# EAGLE design M_D_ext_power-solar1 (EAGLE 9.6.2)
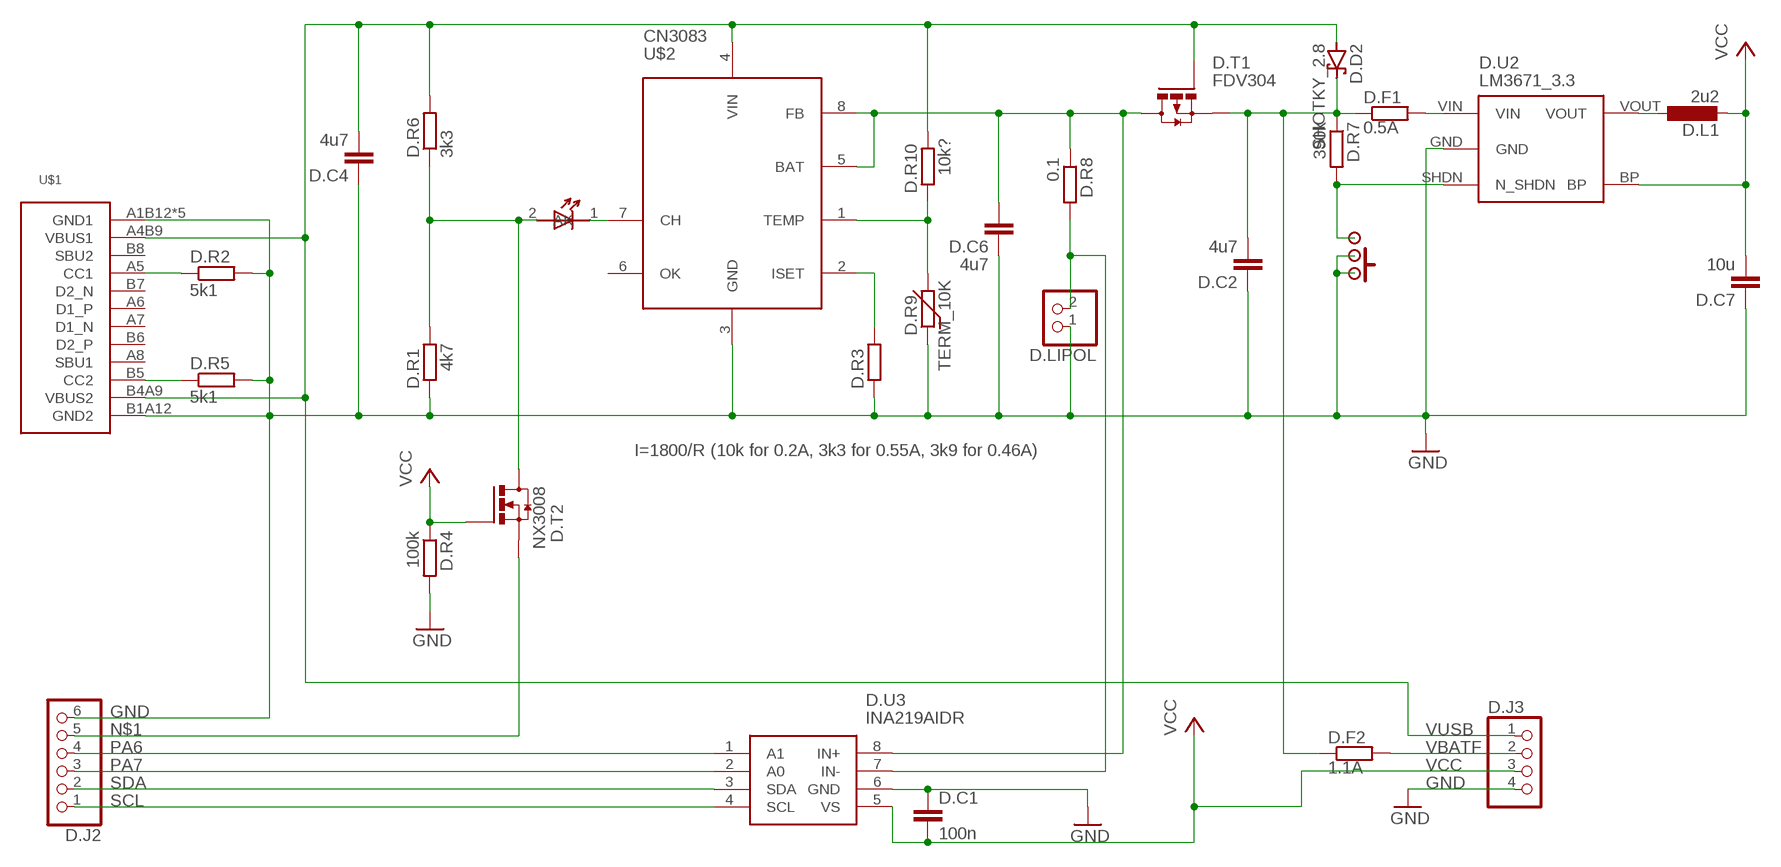
[diagram p0: schematic, sheet 1]

## Parts
D.C1  100n  C-EUC0603  [C0603]
D.C2  4u7  C-EUC0603  [C0603]
D.C4  4u7  C-EUC0603  [C0603]
D.C6  4u7  C-EUC0603  [C0603]
D.C7  10u  C-EUC0805  [C0805]
D.D1  LED_1.8  [LED_1.8]
D.D2  SHOTKY_2.8  [SHOTKY_2.8]
D.F1  0.5A  R-EU_R0805  [R0805]
D.F2  1.1A  R-EU_R0805  [R0805]
D.J2  PINHD-1X6  [1X06]
D.J3  PINHD-1X4  [1X04]
D.L1  2u2  L-EUL3230M  [L3230M]
D.LIPOL  PINHD-1X2  [1X02]
D.ON/OFF/RESET  SWITCH  [SWITCH]
D.R1  4k7  R-EU_R0603  [R0603]
D.R2  5k1  R-EU_R0603  [R0603]
D.R3  I=1800/R (10k for 0.2A, 3k3 for 0.55A, 3k9 for 0.46A)  R-EU_R0603  [R0603]
D.R4  100k  R-EU_R0603  [R0603]
D.R5  5k1  R-EU_R0603  [R0603]
D.R6  3k3  R-EU_R0603  [R0603]
D.R7  390k  R-EU_R0603  [R0603]
D.R8  0.1  R-EU_R0805  [R0805]
D.R9  TERM_10K  THERM  [THERM]
D.R10  10k?  R-EU_R0603  [R0603]
D.T1  FDV304  P-MOSFET  [SO23]
D.T2  NX3008  N-MOSFET  [SO23]
D.U2  LM3671_3.3  STABILISER_APE8865  [SOT32-5]
D.U3  INA219AIDR  [SOIC127P600X175-8N]
U$1  USB-C  [USB-C]
U$2  CN3083  [SOP8]

## Nets
GND: D.C1.1 D.C2.1 D.C4.1 D.C6.1 D.C7.1 D.J2.6 D.J3.4 D.LIPOL.1 D.ON/OFF/RESET.P$1 D.ON/OFF/RESET.P$2 D.ON/OFF/RESET.P$4 D.R1.1 D.R2.2 D.R3.1 D.R4.2 D.R5.2 D.R9.1 D.U2.GND D.U3.6(GND) U$1.A1B12(GND1) U$1.B1A12(GND2) U$1.SH1(GND1) U$1.SH2(GND1) U$1.SH3(GND1) U$1.SH4(GND1) U$2.3(GND)
IN+: D.LIPOL.2 D.R8.2 D.U3.7(IN-)
IN-: D.C6.2 D.R8.1 D.T1.D D.U3.8(IN+) U$2.5(BAT) U$2.8(FB)
N$1: D.J2.5 D.T2.S
N$2: D.L1.1 D.U2.VOUT
N$3: D.D1.1(K) U$2.7(CH)
N$4: D.R5.1 U$1.B5(CC2)
N$5: D.ON/OFF/RESET.P$3 D.ON/OFF/RESET.P$5 D.R7.2 D.U2.SHDN(N_SHDN)
N$6: D.R2.1 U$1.A5(CC1)
N$7: D.R3.2 U$2.2(ISET)
N$8: D.R9.2 D.R10.1 U$2.1(TEMP)
N$9: D.F1.2 D.U2.VIN
PA3: D.D1.2(A) D.R1.2 D.R6.1 D.T2.D
PA6: D.J2.4 D.U3.1(A1)
PA7: D.J2.3 D.U3.2(A0)
SCL: D.J2.1 D.U3.4(SCL)
SDA: D.J2.2 D.U3.3(SDA)
VBATF: D.F2.2 D.J3.2
VCC: D.C1.2 D.C7.2 D.J3.3 D.L1.2 D.R4.1 D.T2.G D.U2.BP D.U3.5(VS)
VMOT: D.C2.2 D.D2.K(C) D.F1.1 D.F2.1 D.R7.1 D.T1.S
VUSB: D.C4.2 D.D2.A D.J3.1 D.R6.2 D.R10.2 D.T1.G U$1.A4B9(VBUS1) U$1.B4A9(VBUS2) U$2.4(VIN)
Unconnected: U$1.A6(D1_P) U$1.A7(D1_N) U$1.A8(SBU1) U$1.B6(D2_P) U$1.B7(D2_N) U$1.B8(SBU2) U$2.6(OK)

## Library data of the parts
D.C1 D.C2 D.C4 D.C6 D.C7 = rcl:C-EU: CAPACITOR, European symbol; SPICEPREFIX: C
D.D1 = hugo:LED_1.8
D.D2 = hugo:SHOTKY_2.8
D.F1 D.F2 D.R1-D.R8 D.R10 = rcl:R-EU_: RESISTOR, European symbol; SPICEPREFIX: R
D.J2 = pinhead2:PINHD-1X6: PIN HEADER
D.J3 = pinhead2:PINHD-1X4: PIN HEADER
D.L1 = rcl:L-EU: INDUCTOR, European symbol; SPICEPREFIX: L
D.LIPOL = pinhead2:PINHD-1X2: PIN HEADER
D.ON/OFF/RESET = hugo:SWITCH
D.R9 = hugo:THERM
D.T1 = hugo:P-MOSFET
D.T2 = hugo:N-MOSFET
D.U2 = !stavebnice03:STABILISER_APE8865
D.U3 = SamacSys_Parts:INA219AIDR: 26-V, Bidirectional, Zero-Drift, High-Side, I2C Out Current/Power Monitor Source: Datasheet <http://www.ti.com/lit/gpn/ina219>; DESCRIPTION: 26-V, Bidirectional, Zero-Drift, High-Side, I2C Out Current/Power Monitor; HEIGHT: 1.75mm; MANUFACTURER_NAME: Texas Instruments; MANUFACTURER_PART_NUMBER: INA219AIDR; MOUSER_PART_NUMBER: 595-INA219AIDR; MOUSER_PRICE-STOCK: https://www.mouser.co.uk/ProductDetail/Texas-Instruments/INA219AIDR?qs=XGzIaZb%2FFYIE5YcOHTnKDA%3D%3D
U$1 = hugo:USB-C
U$2 = hugo:CN3083

## Board
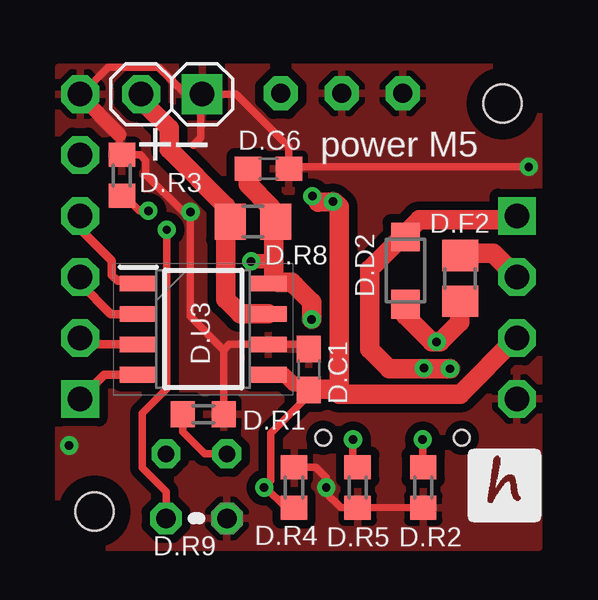
[diagram p1: board, top side]
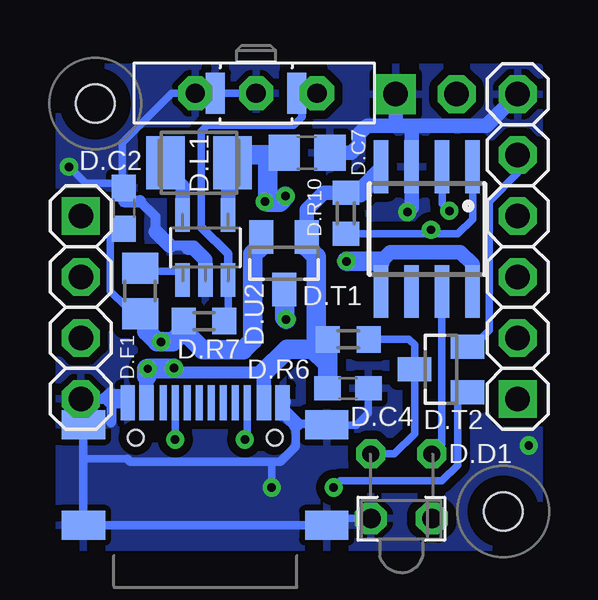
[diagram p2: board, bottom side, seen from below]

No outline drawn. Coordinates in mm, seen from the top.
Copper layers (1*16): Top 0.035mm / dielectric 1.5mm / Bottom 0.035mm
Design rules "default *": minimum track width 10mil, minimum drill 0.35mm, track to track 6mil, track to pad 6mil, pad to pad 6mil, via to via 10mil, smd to smd 10mil, copper to edge 15mil, drill to drill 15mil, minimum pad ring 10mil, minimum via ring 8mil, stop-mask expansion 4mil, vias tented up to drill 0mil, thermal gap 10mil
Holes 1.6 mm at 2,2 19,19
tRestrict: area 18,18 to 20,20; area 1,1 to 3,3
bRestrict: area 1,1 to 3,3; area 18,18 to 20,20

### Footprints (pad centres in the part's own frame; a part is rotated, then mirrored left to right if it is on the bottom)
C0603 = smd 1.1 x 1: 1 -0.85,0; 2 0.85,0
C0805 = smd 1.3 x 1.5: 1 -0.95,0; 2 0.95,0
LED_1.8 = drill 0.7 octagon: 1 -1.27,-0.4; 2 1.27,-0.4
SHOTKY_2.8 = smd 1.2 x 1.2: A -1.4,0; K 1.4,0
R0805 = smd 1.3 x 1.5: 1 -0.95,0; 2 0.95,0
1X06 = drill 1.016 pad 1.575 square: 1 -6.35,0 | drill 1.016 pad 1.575 octagon: 2 -3.81,0; 3 -1.27,0; 4 1.27,0; 5 3.81,0; 6 6.35,0
1X04 = drill 1.016 pad 1.575 square: 1 -3.81,0 | drill 1.016 pad 1.575 octagon: 2 -1.27,0; 3 1.27,0; 4 3.81,0
L3230M = smd 1.6 x 2.2: 1 -1.4,0; 2 1.4,0
1X02 = drill 1.016 pad 1.676 square: 1 -1.27,0 | drill 1.016 pad 1.575 octagon: 2 1.27,0
SWITCH = drill 0.8 pad 1.422 octagon: P$1 -2.54,0; P$2 0,0; P$3 2.54,0 | smd 0.8 x 1.7: P$4 -1.7,0; P$5 1.7,0
R0603 = smd 1 x 1.1: 1 -0.85,0; 2 0.85,0
THERM = drill 0.813 octagon: 1 -1.27,0; 2 1.27,0
SO23 = smd 1 x 1.4: D 0,1.1; G -0.95,-1.1; S 0.95,-1.1
SOT32-5 = smd 0.6 x 1.4: BP 0.95,1.35; GND 0,-1.35; SHDN 0.95,-1.35; VIN -0.95,-1.35; VOUT -0.95,1.35
SOIC127P600X175-8N = smd 1.528 x 0.65: 1 -2.711,1.905; 2 -2.711,0.635; 3 -2.711,-0.635; 4 -2.711,-1.905; 5 2.711,-1.905; 6 2.711,-0.635; 7 2.711,0.635; 8 2.711,1.905
USB-C = smd 0.6 x 1.45: A1B12 -3.235,3.825; A4B9 -2.46,3.825; B1A12 3.215,3.825; B4A9 2.44,3.825 | smd 0.3 x 1.45: A5 -1.26,3.825; A6 -0.26,3.825; A7 0.24,3.825; A8 1.24,3.825; B5 1.74,3.825; B6 0.74,3.825; B7 -0.76,3.825; B8 -1.76,3.825 | smd 1.8 x 1.2: SH1 -5.08,2.91; SH2 -5.08,-1.27; SH3 5.06,-1.27; SH4 5.06,2.91 | hole 0.65: 2.88,2.38; -2.9,2.38
SOP8 = smd 0.6 x 2.2: 1 -1.905,-2.6; 2 -0.635,-2.6; 3 0.635,-2.6; 4 1.905,-2.6; 5 1.905,2.6; 6 0.635,2.6; 7 -0.635,2.6; 8 -1.905,2.6

### Placement (x,y rotation side)
D.C1  10.92,7.92 270 top
D.C2  17.81,14.63 270 bottom
D.C4  8.47,7.13 180 bottom
D.C6  9.25,16.29 180 top
D.C7  10.17,16.95 180 bottom
D.D1  6.25,4 180 bottom
D.D2  14.96,12.04 270 top
D.F1  17.13,11.18 90 bottom
D.F2  17.24,11.71 90 top
D.J2  1.4,13.04 90 bottom
D.J3  19.6,10.5 270 bottom
D.L1  14.68,16.54 0 bottom
D.LIPOL  5.21,19.39 180 top
D.ON/OFF/RESET  12.3,19.42 0 bottom
D.R1  6.53,6.05 180 top
D.R2  15.7,3 270 top
D.R3  3.14,16 270 top
D.R4  10.31,3 90 top
D.R5  12.96,3 270 top
D.R6  8.46,9.17 180 bottom
D.R7  14.47,9.93 0 bottom
D.R8  8.6,14.08 180 top
D.R9  6.25,1.71 180 top
D.R10  8.56,14.43 90 bottom
D.T1  11.13,12.34 180 bottom
D.T2  4.6,7.92 90 bottom
D.U2  14.41,13 0 bottom
D.U3  6.53,9.6 0 top
U$1  14.41,2.7 0 bottom
U$2  5.18,13.77 180 bottom

### Tracks (layer width: path | path; a pad name or v marks a point on that pad's centre or on a via)
GND  (via drill 0.35)
  Top 0.305: 11.16,9.01 D.C1.1 10.73,8.97 D.U3.6 7.62,8.97 7.38,8.73 | D.R2.2 15.7,2.17 D.R5.2 12.25,2.17 11.65,2.77 v11.65,3 11.65,3.4 11.21,3.85 D.R4.2 | D.LIPOL.1 7.91,19.39 10.1,17.2 D.C6.1 10.17,16.36 v20.09,16.36 | 1.4,19.33 D.J2.6 1.46,19.39 2.58,20.51 4.67,20.51 6.43,18.75 6.43,17.57 6.12,17.26 | 3.04,17.69 3.04,16.96 D.R3.1 | D.R3.1 3.37,16.63 | 7.38,8.73 D.R1.1 | 7.38,8.73 5.98,10.12 5.98,14.46 v6,14.48 5.69,14.48 4.14,16.03 4.14,16.61 3.9,16.86 D.R3.1
  Top 0.61: 3.04,17.69 1.4,19.33
  Bottom 0.254: 6.15,17.97 6.03,18.08
  Bottom 0.305: 17.68,4.2 19.49,4.2 19.49,4.19 | 17.87,15.82 17.87,17.36 15.81,19.42 D.ON/OFF/RESET.P$1 | 6.75,19.66 D.LIPOL.1 | 11.65,3.13 v11.65,3 | v11.65,3 11.63,2.97 | D.ON/OFF/RESET.P$1 D.ON/OFF/RESET.P$2 | D.ON/OFF/RESET.P$4 D.ON/OFF/RESET.P$1 | v20.09,16.36 19.41,15.67 18,15.67 D.C2.1 17.8,14.94 | v11.65,3 11.65,4.07 | D.R9.1 9.07,1.71 U$1.SH3 | 9.45,5.71 9.4,5.66 9.33,5.59 8.13,5.59 7.62,6.1 D.C4.1 | v6,14.48 5.82,14.66
  Bottom 0.356: 6.48,17.96 D.LIPOL.1 | U$1.SH3 U$1.SH2 19.49,4.19 U$1.SH1 | 11.2,6.2 U$1.B1A12 | 17.68,4.2 17.55,4.07 11.65,4.07 | 12.52,4.07 11.29,4.07 10.65,4.71 10.65,5.45 10.75,5.55 10.65,5.65 | 10.63,5.64 10.61,5.66 9.4,5.66 | 9.45,5.71 U$1.SH4
  Bottom 0.406: 18.37,6.98 18.5,6.85 | 18.5,6.85 18.66,6.69 | U$1.A1B12 17.82,6.7 17.84,6.69 | 18.66,6.69 D.J3.4 19.6,5.72 | 18.66,6.69 18.31,6.69 | 18.5,6.85 18.34,6.68 18.34,5.71 | 15.14,12.99 15.21,13.06 15.89,13.06 | 16.48,13.65 16.48,14.28 17.14,14.94
  Bottom 0.508: 17.8,14.94 17.14,14.94
  Bottom 0.61: D.LIPOL.1 6.48,18.08 6.03,18.08 5.82,18.08 | D.U2.GND 14.41,12.49 14.91,12.99 15.14,12.99 | 10.63,5.64 10.65,5.65 11.2,6.2 | 8.81,5.84 9.12,5.84 U$1.SH4 9.22,5.74 | 19.6,5.72 U$1.SH1 | D.C7.1 8.33,16.95 8.03,17.25 8.03,17.71 7.67,18.07 6.51,18.07 | 5.82,18.08 2.71,18.08 D.J2.6 | U$1.B1A12 11.14,6.58 | 5.82,18.08 U$2.3 5.82,14.66 | 15.89,13.06 16.48,13.65
  Bottom 0.813: 18.31,6.69 17.84,6.69
  other vias: 0.94,4.75
  pour Top (isolate 0.356): 0.5,20.5 0.5,0.5 20.5,0.5 20.5,20.5
  pour Bottom (isolate 0.356, rank 3): 0.5,20.5 20.5,20.5 20.5,0.5 0.5,0.5
IN+
  Top 0.813: D.LIPOL.2 3.94,19.14 5.11,17.97 5.11,17.09 7.47,14.73 7.47,14.25 D.R8.2 7.47,13.89 7.47,10.84 8.07,10.24 D.U3.7
IN-  (via drill 0.35)
  Top 0.305: 10.34,11.43 10.21,11.56 | 9.83,11.56 9.63,11.56 | 9.55,11.63 9.37,11.63 D.U3.8 9.39,11.66 9.39,12.42
  Top 0.61: v8.53,12.42 9.39,12.42
  Top 0.813: D.R8.1 9.35,14.28 9.35,14.68 8.4,15.63 D.C6.2 | D.R8.1 9.64,14.08 | v11.05,10.01 11.05,10.72 10.34,11.43 | D.R8.1 9.47,14 9.47,11.71 9.55,11.63 9.63,11.56 | 10.21,11.56 9.83,11.56
  Bottom 0.305: U$2.5 7.09,12.39 7.12,12.42
  Bottom 0.61: 7.09,11.76 U$2.5 7.09,12.42 6.71,12.8 3.79,12.8 3.28,12.29 U$2.8
  Bottom 0.813: D.T1.D 11.11,11.22 11.11,10.07 v11.05,10.01 | 7.12,12.42 v8.53,12.42
N$1
  Bottom 0.305: D.J2.5 1.4,16.11 2.59,14.91 2.59,9.55 3.27,8.88 D.T2.S
N$2
  Bottom 0.61: D.U2.VOUT 15.36,15.54 16.08,16.25 D.L1.1
N$3
  Bottom 0.305: U$2.7 4.57,11.14 4.57,4.8 D.D1.1
N$4  (via drill 0.35)
  Top 0.305: D.R5.1 12.77,4.06 v12.77,5
  Bottom 0.305: U$1.B5 12.67,5.1 v12.77,5
N$5
  Bottom 0.305: 14.58,13.85 14.58,17.85 14.33,18.09 10.74,18.09 10.38,18.45 D.ON/OFF/RESET.P$5 D.ON/OFF/RESET.P$3 | D.U2.SHDN 13.46,10.09 D.R7.2
  Bottom 0.356: 13.45,11.63 D.U2.SHDN 13.46,12.73 14.58,13.85 | 13.45,10.11 D.R7.2
N$6  (via drill 0.35)
  Top 0.305: v15.67,5 15.67,3.9 D.R2.1
  Bottom 0.305: U$1.A5 v15.67,5
N$7  (via drill 0.35)
  Top 0.305: 3.27,15.15 D.R3.2 3.23,15.15 3.87,14.53 v4.25,14.53
  Bottom 0.305: U$2.2 4.55,14.83 v4.25,14.53
N$8  (via drill 0.35)
  Top 0.305: D.R9.2 4.98,2.83 3.99,3.82 3.99,6.1 5,7.11 v5,13.73 v5.01,13.74
  Bottom 0.305: v5.01,13.74 5.01,13.59 | 5.01,13.59 4.99,13.56 3.89,13.56 3.28,14.18 U$2.1 | D.R10.1 8.55,13.56 5.04,13.56 5.01,13.59
N$9
  Bottom 0.305: D.U2.VIN 15.36,11.88 15.49,12.01 17.01,12.01 D.F1.2
  Bottom 0.813: D.F1.2 16.98,12.13
PA3
  Top 0.305: D.R1.2 5.68,5.32 6.6,4.4 D.D1.2
  Bottom 0.305: 7.61,9.05 D.R6.1 5.93,9.17 5.7,8.94 D.T2.D 5.7,5.25 6.55,4.4 D.D1.2
PA6
  Top 0.356: D.U3.1 3.71,11.61 2.96,11.61 2.72,11.85 2.72,12.45 1.4,13.77 D.J2.4
PA7
  Top 0.305: D.J2.3 1.4,11.51
  Top 0.356: 1.4,11.51 2.69,10.22 3.8,10.22 D.U3.2
SCL
  Top 0.356: D.U3.4 2.41,7.7 D.J2.1
SDA
  Top 0.305: 3.81,8.98 D.U3.3
  Top 0.356: D.U3.3 1.9,8.97 1.78,8.85 D.J2.2
VBATF
  Top 0.813: D.J3.2 18.61,12.76 17.33,12.76 D.F2.2
VCC  (via drill 0.35)
  Top 0.254: D.C1.2 12.14,7.07 12.22,6.99
  Top 0.305: D.R4.1 10.21,2.23 9.92,2.23 9.14,3 v9.07,3 9.35,3.28 9.35,5.26 10.93,6.84 D.C1.2 12.01,7.07 | 11.32,14.89 v11.07,15.14
  Top 0.356: D.C1.2 10.88,7.11
  Top 0.61: D.C1.2 10.7,7.3 10.31,7.3 9.88,7.72 9.26,7.72 D.U3.5 | 11.99,14.89 v11.94,14.91 | 12.22,6.99 12.12,6.99
  Top 0.813: 11.99,14.89 12.19,14.7 12.19,7.09 | 12.19,7.09 12.19,6.89 17.24,6.89 19.58,9.23 D.J3.3 | D.C1.2 10.95,7.09 12.19,7.09 | v11.94,14.91 11.32,14.89
  Bottom 0.305: D.T2.G 3.9,6.57 3.9,3.93 4.56,3.28 8.79,3.28 v9.07,3
  Bottom 0.356: v11.94,14.91 11.94,14.89
  Bottom 0.61: D.L1.2 13.28,15.96 13.46,15.78 D.U2.BP | 12.81,17 D.L1.2 | D.C7.2 11.15,16.98 11.99,16.98 11.89,16.87 11.81,16.79 | D.L1.2 12.94,16.87
  Bottom 0.813: 11.89,16.87 12.94,16.87 | 11.81,16.79 11.81,14.89 11.32,14.89 v11.07,15.14
VMOT  (via drill 0.35)
  Top 0.813: D.F2.1 17.22,10.75 17.22,9.88 16.41,9.07 v16.26,9.07 16.05,9.07 14.96,10.16 D.D2.K
  Bottom 0.254: 17.72,10.54 17.44,10.54 D.F1.1
  Bottom 0.305: D.C2.2 17.99,13.78 18.37,13.41 18.37,11.19 17.72,10.54 | 15.32,9.53 D.R7.1 15.32,9.88 15.22,9.78
  Bottom 0.813: D.T1.S 12.08,13.06 12.43,12.71 12.43,9.14 12.84,8.73 14.53,8.73 15.22,9.42 15.22,9.78 | D.F1.1 16.86,9.95 16.86,9.52 16.41,9.07 v16.26,9.07 15.78,9.07 15.32,9.53
VUSB  (via drill 0.35)
  Top 0.813: D.J3.1 19.45,14.16 15.53,14.16 14.95,13.58 | 14.95,13.58 D.D2.A | v16.81,7.95 14.28,7.95 13.46,8.76 13.46,12.09 14.95,13.58
  Bottom 0.305: 9.34,9.26 9.34,9.21 D.R6.2 9.52,9.17
  Bottom 0.508: U$1.B4A9 11.97,7.5 | 11.98,7.78 16.73,7.78
  Bottom 0.61: 10.18,13.57 D.T1.G 10.18,14.58 9.49,15.28 D.R10.2 | v16.81,7.95 16.86,7.95 | 11.97,7.81 11.97,7.76 | U$1.B4A9 11.97,7.5 11.97,7.76 | 11.97,7.76 11.98,7.78 | 16.73,7.78 16.86,7.64 16.87,7.63 U$1.A4B9 | U$2.4 7.09,16.32 7.37,16.03 7.37,15.88
  Bottom 0.813: 16.86,7.95 16.86,7.64 | 11.97,7.81 11.01,8.77 9.98,8.77 9.96,8.79 | D.T1.G 10.18,13.01 9.79,12.62 9.79,8.95 9.96,8.79 | v16.81,7.95 16.79,7.98 v15.72,7.98 | 7.37,15.88 7.98,15.28 D.R10.2 | 9.96,8.79 9.32,8.15 D.C4.2 9.32,9.23 9.34,9.26

### Text on the board
tPlace: + | − | power M5